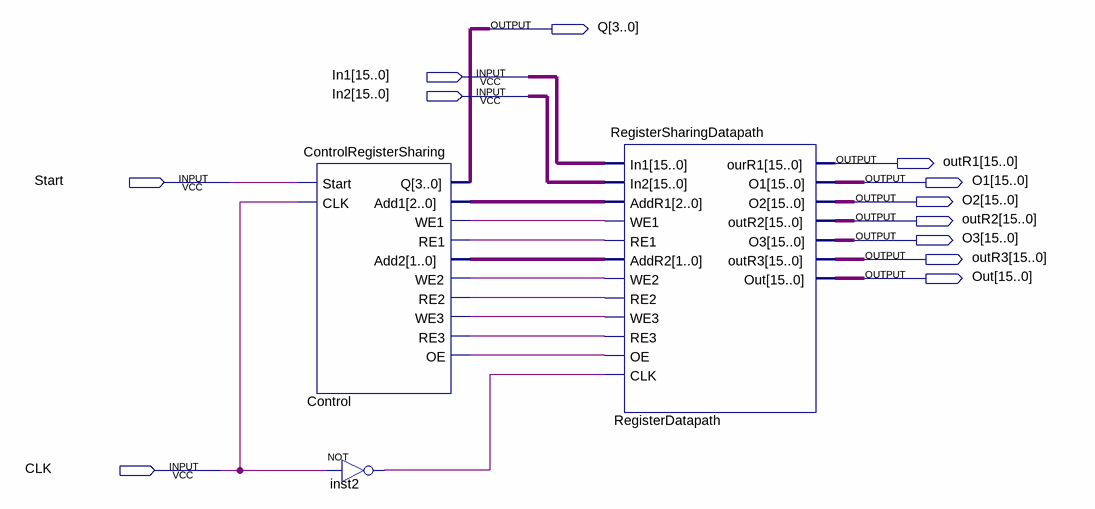
[diagram p0: schematic sheet]
// Quartus schematic RegisterSharing.bdf as structural Verilog: 3 symbols, 12 pins
module RegisterSharing (
  input  [15:0] In1,
  input  [15:0] In2,
  input  Start,
  input  CLK,
  output [3:0] Q,
  output [15:0] outR1,
  output [15:0] O1,
  output [15:0] O2,
  output [15:0] outR2,
  output [15:0] O3,
  output [15:0] outR3,
  output [15:0] Out
);

  wire Control_oe, Control_re1, Control_re2, Control_re3, Control_we1, Control_we2, Control_we3, inst2_out;
  wire [1:0] Control_add2;
  wire [2:0] Control_add1;

  ControlRegisterSharing Control (
    .Start(Start), .CLK(CLK), .Q(Q), .Add1(Control_add1), .WE1(Control_we1), .RE1(Control_re1),
    .Add2(Control_add2), .WE2(Control_we2), .RE2(Control_re2), .WE3(Control_we3), .RE3(Control_re3),
    .OE(Control_oe));
  not inst2 (inst2_out, CLK);
  RegisterSharingDatapath RegisterDatapath (
    .In1(In1), .In2(In2), .AddR1(Control_add1), .WE1(Control_we1), .RE1(Control_re1), .AddR2(Control_add2),
    .WE2(Control_we2), .RE2(Control_re2), .WE3(Control_we3), .RE3(Control_re3), .OE(Control_oe),
    .CLK(inst2_out), .ourR1(outR1), .O1(O1), .O2(O2), .outR2(outR2), .O3(O3), .outR3(outR3), .Out(Out));
endmodule
